# EAGLE design pic18f13k50_3 (EAGLE 6.5.0)
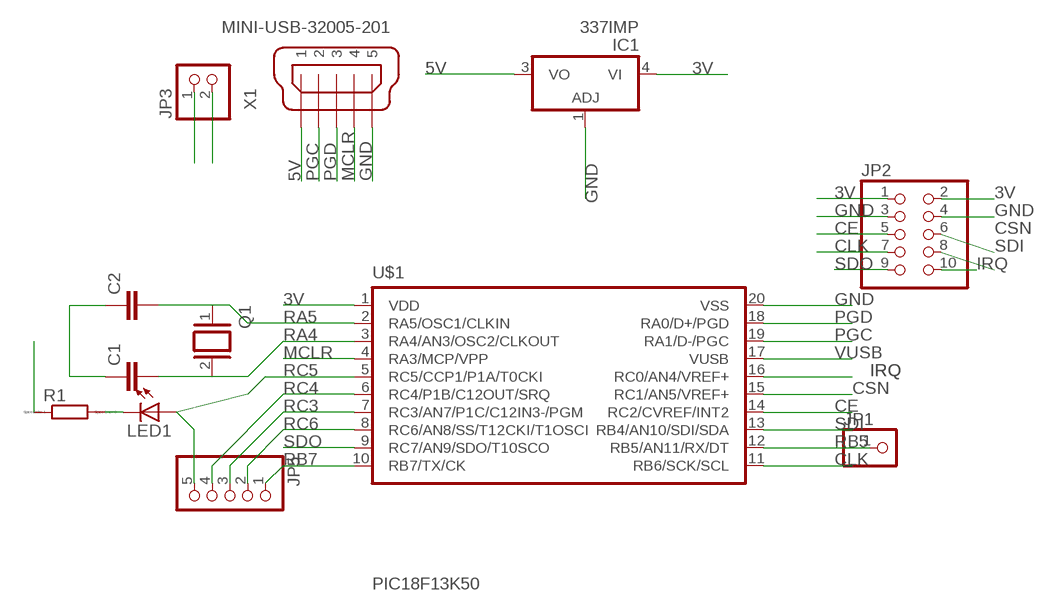
[diagram p0: schematic, sheet 1]

## Parts
C1  C-EUC0805  [C0805]
C2  C-EUC0805  [C0805]
IC1  337IMP  [SOT223]
JP1  PINHD-1X1  [1X01]
JP2  PINHD-2X5  [2X05]
JP3  PINHD-1X2  [1X02]
JP5  PINHD-1X5  [1X05]
LED1  LEDCHIP-LED0805  [CHIP-LED0805]
Q1  XTAL/S  [QS]
R1  R  [R0805]
U$1  PIC18F13K50  [SSOP20]
X1  MINI-USB-32005-201  [32005-201]

## Nets
3V: IC1.4(VI) JP2.1 JP2.2 JP3.1 R1.1 U$1.1(VDD)
5V: IC1.3(VO) JP3.2 X1.1
CE: JP2.5 U$1.14(RC2/CVREF/INT2)
CLK: JP2.7 U$1.11(RB6/SCK/SCL)
CSN: JP2.6 U$1.15(RC1/AN5/VREF+)
GND: C1.1 C2.1 IC1.1(ADJ) JP2.3 JP2.4 U$1.20(VSS) X1.5
IRQ: JP2.10 U$1.16(RC0/AN4/VREF+)
MCLR: U$1.4(RA3/MCP/VPP) X1.4
N$1: LED1.C R1.2
PGC: U$1.19(RA1/D-/PGC) X1.2
PGD: U$1.18(RA0/D+/PGD) X1.3
RA4: C1.2 Q1.2 U$1.3(RA4/AN3/OSC2/CLKOUT)
RA5: C2.2 Q1.1 U$1.2(RA5/OSC1/CLKIN)
RB5: JP1.1 U$1.12(RB5/AN11/RX/DT)
RB7: JP5.1 U$1.10(RB7/TX/CK)
RC3: JP5.3 U$1.7(RC3/AN7/P1C/C12IN3-/PGM)
RC4: JP5.4 U$1.6(RC4/P1B/C12OUT/SRQ)
RC5: JP5.5 LED1.A U$1.5(RC5/CCP1/P1A/T0CKI)
RC6: JP5.2 U$1.8(RC6/AN8/SS/T12CKI/T1OSCI)
SDI: JP2.8 U$1.13(RB4/AN10/SDI/SDA)
SDO: JP2.9 U$1.9(RC7/AN9/SDO/T10SCO)
VUSB: U$1.17(VUSB)

## Library data of the parts
C1 C2 = rcl:C-EU: CAPACITOR, European symbol
IC1 = linear:*337: Negative VOLTAGE REGULATOR
JP1 = pinhead:PINHD-1X1: PIN HEADER
JP2 = pinhead:PINHD-2X5: PIN HEADER
JP3 = pinhead:PINHD-1X2: PIN HEADER
JP5 = pinhead:PINHD-1X5: PIN HEADER
LED1 = led:LED: LED OSRAM: - CHIPLED LG R971, LG N971, LY N971, LG Q971, LY Q971, LO R971, LY R971 LH N974, LH R974 LS Q976, LO Q976, LY Q976 LO Q996 - Hyper CHIPLED LW Q18S LB Q993, LB Q99A, LB R99A - SideLED LS A670, LO A670, LY A670, LG A670, LP A670 LB A673, LV A673, LT A673, LW A673 LH A674 LY A675 LS A676, LA A676, LO A676, LY A676, LW A676 LS A679, LY A679, LG A679 - Hyper Micro SIDELED® LS Y876, LA Y876, LO Y876, LY Y876 LT Y87S - SmartLED LW L88C, LW L88S LB L89C, LB L89S, LG L890 LS L89K, LO L89K, LY L89K LS L896, LA L896, LO L896, LY L896 - TOPLED LS T670, LO T670, LY T670, LG T670, LP T670 LSG T670, LSP T670, LSY T670, LOP T670, LYG T670 LG T671, LOG T671, LSG T671 LB T673, LV T673, LT T673, LW T673 LH T674 LS T676, LA T676, LO T676, LY T676, LB T676, LH T676, LSB T676, LW T676 LB T67C, LV T67C, LT T67C, LS T67K, LO T67K, LY T67K, LW E67C LS E67B, LA E67B, LO E67B, LY E67B, LB E67C, LV E67C, LT E67C LW T67C LS T679, LY T679, LG T679 LS T770, LO T770, LY T770, LG T770, LP T770 LB T773, LV T773, LT T773, LW T773 LH T774 LS E675, LA E675, LY E675, LS T675 LS T776, LA T776, LO T776, LY T776, LB T776 LHGB T686 LT T68C, LB T68C - Hyper Mini TOPLED® LB M676 - Mini TOPLED Santana® LG M470 LS M47K, LO M47K, LY M47K Source: http://www.osram.convergy.de LUXEON: - LUMILED® LXK2-PW12-R00, LXK2-PW12-S00, LXK2-PW14-U00, LXK2-PW14-V00 LXK2-PM12-R00, LXK2-PM12-S00, LXK2-PM14-U00 LXK2-PE12-Q00, LXK2-PE12-R00, LXK2-PE12-S00, LXK2-PE14-T00, LXK2-PE14-U00 LXK2-PB12-K00, LXK2-PB12-L00, LXK2-PB12-M00, LXK2-PB14-N00, LXK2-PB14-P00, LXK2-PB14-Q00 LXK2-PR12-L00, LXK2-PR12-M00, LXK2-PR14-Q00, LXK2-PR14-R00 LXK2-PD12-Q00, LXK2-PD12-R00, LXK2-PD12-S00 LXK2-PH12-R00, LXK2-PH12-S00 LXK2-PL12-P00, LXK2-PL12-Q00, LXK2-PL12-R00 Source: www.luxeon.com KINGBRIGHT: KA-3528ASYC Source: www.kingbright.com
Q1 = special:XTAL/S: CRYSTAL
R1 = eagle-ltspice:R: RESISTOR, European symbol; SPICEMODEL: NONE; SPICEPREFIX: R
U$1 = microchip-7:PIC18F13K50
X1 = con-cypressindustries 2:MINI-USB-: MINI USB-B Conector Source: www.cypressindustries.com

## Board
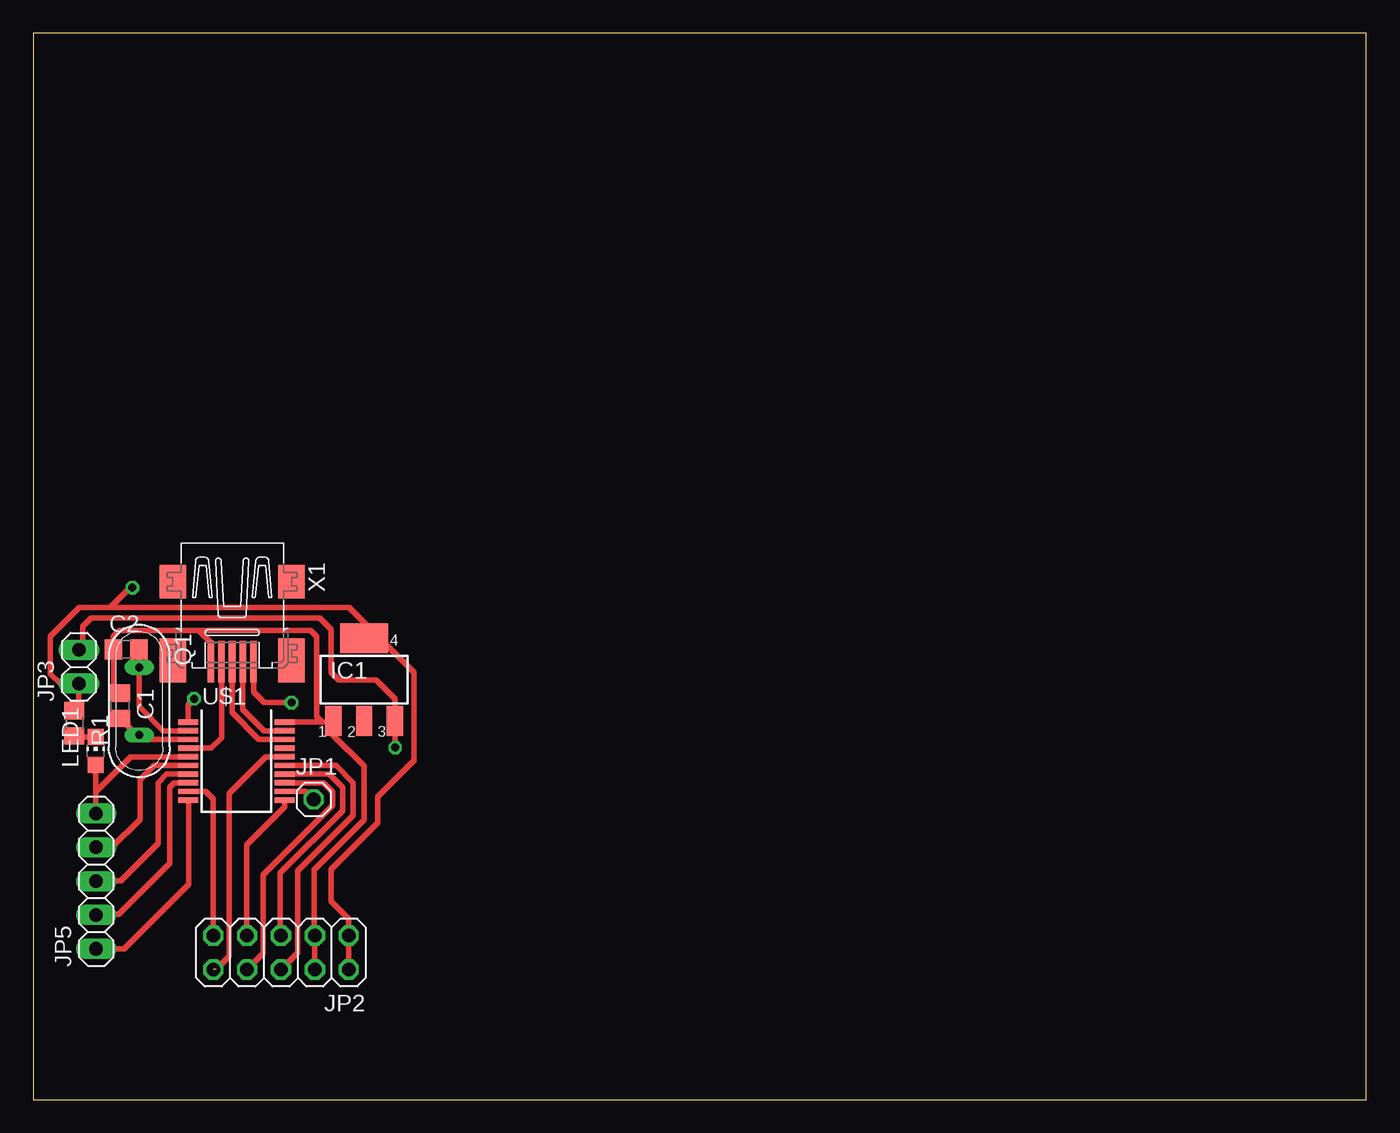
[diagram p1: board, top side]
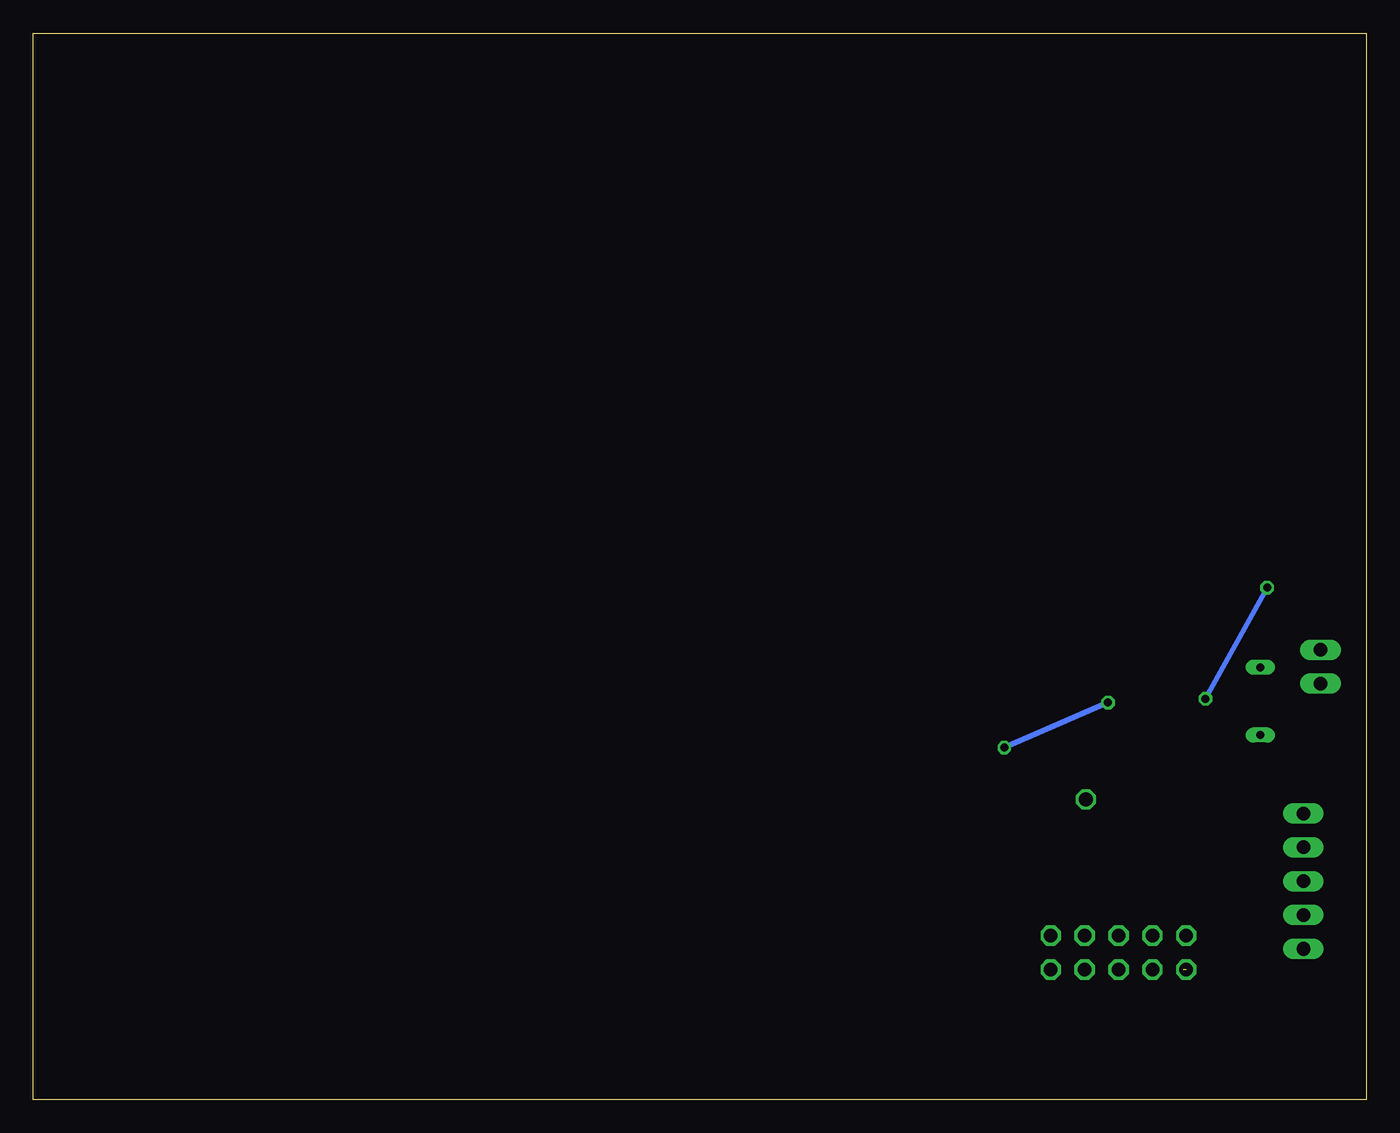
[diagram p2: board, bottom side, seen from below]

Size 100 x 80 mm. Coordinates in mm from the lower left corner, seen from the top.
Outline: 0,0 100,0 100,80 0,80 0,0
Copper layers (1*16): Top 0.035mm / dielectric 1.5mm / Bottom 0.035mm
Design rules "default": minimum track width 10mil, minimum drill 24mil, track to track 8mil, track to pad 8mil, pad to pad 8mil, via to via 8mil, smd to smd 8mil, copper to edge 40mil, drill to drill 8mil, minimum pad ring 10mil, minimum via ring 8mil, stop-mask expansion 4mil, vias tented up to drill 0mil, thermal gap 10mil

### Footprints (pad centres in the part's own frame; a part is rotated, then mirrored left to right if it is on the bottom)
C0805 = smd 1.3 x 1.5: 1 -0.95,0; 2 0.95,0
SOT223 = smd 1.219 x 2.235: 1 -2.311,-3.099; 2 0,-3.099; 3 2.311,-3.099 | smd 3.6 x 2.2: 4 0,3.099
1X01 = drill 1.016 octagon: 1 0,0
2X05 = drill 1.016 octagon: 1 -5.08,-1.27; 2 -5.08,1.27; 3 -2.54,-1.27; 4 -2.54,1.27; 5 0,-1.27; 6 0,1.27; 7 2.54,-1.27; 8 2.54,1.27; 9 5.08,-1.27; 10 5.08,1.27
1X02 = drill 1.016 long: 1 -1.27,0; 2 1.27,0
1X05 = drill 1.016 long: 1 -5.08,0; 2 -2.54,0; 3 0,0; 4 2.54,0; 5 5.08,0
CHIP-LED0805 = smd 1.2 x 1.2: A 0,-1.05; C 0,1.05
QS = drill 0.61 long: 1 -2.54,0; 2 2.54,0
R0805 = smd 1.3 x 1.5: 1 -0.95,0; 2 0.95,0
SSOP20 = smd 0.4 x 1.5: 1 -2.925,-3.625; 2 -2.275,-3.625; 3 -1.625,-3.625; 4 -0.975,-3.625; 5 -0.325,-3.625; 6 0.325,-3.625; 7 0.975,-3.625; 8 1.625,-3.625; 9 2.275,-3.625; 10 2.925,-3.625; 11 2.925,3.625; 12 2.275,3.625; 13 1.625,3.625; 14 0.975,3.625; 15 0.325,3.625; 16 -0.325,3.625; 17 -0.975,3.625; 18 -1.625,3.625; 19 -2.275,3.625; 20 -2.925,3.625
32005-201 = smd 3.1 x 0.5: 1 3,1.6; 2 3,0.8; 3 3,0; 4 3,-0.8; 5 3,-1.6 | smd 2.5 x 2: M1 -3,-4.45; M2 -3,4.45 | smd 3.3 x 2: M3 2.9,4.45; M4 2.9,-4.45

### Placement (x,y rotation side)
C1  6.52,29.55 270 top
C2  6.97,33.78 0 top
IC1  24.82,31.5 0 top
JP1  21.03,22.52 0 top
JP2  18.58,11.03 180 top
JP3  3.42,32.47 90 top
JP5  4.71,16.39 90 top
LED1  4.69,26.17 0 top
Q1  7.94,29.89 270 top
R1  3.09,28.23 270 top
U$1  15.24,25.4 270 top
X1  14.92,35.85 270 top

### Tracks (layer width: path | path; a pad name or v marks a point on that pad's centre or on a via)
3V  (via drill 0.6)
  Top 0.406: 26.06,34.6 IC1.4 24.86,34.56 24.86,34.06 24.8,34.12 24.8,35.38 | 5.77,36.92 23.69,36.92 25.23,35.38 | 5.77,36.92 3.43,36.92 1.26,34.75 1.26,31.95 2,31.2 JP3.1 3.42,29.52 R1.1 | 24.8,35.38 24.75,35.38 | U$1.1 11.62,29.62 v12.06,30.06 | v7.43,38.41 7.26,38.41 5.77,36.92 | 25.23,35.38 28.57,32.03 28.57,25.43 25.83,22.69 25.83,20.75 22.35,17.26 22.35,14.86 23.66,13.54 JP2.1 JP2.2 | 24.8,35.38 25.23,35.38
  Bottom 0.406: v12.06,30.06 v7.43,38.41
5V  (via drill 0.6)
  Top 0.406: X1.1 16.52,30.57 17.32,29.77 v19.37,29.77 | v27.15,26.4 27.15,28.39 IC1.3 27.13,30.07 25.72,31.49 22.92,31.49 22.35,32.06 22.35,35.26 21.49,36.12 4.34,36.12 3.71,35.49 3.71,34.04 JP3.2
  Bottom 0.406: v19.37,29.77 v27.15,26.4
CE
  Top 0.406: U$1.14 22.21,24.43 23.2,23.43 23.2,21.66 18.54,16.99 18.54,12.34 JP2.5
CLK
  Top 0.406: U$1.11 18.86,21.95 16,19.09 16,12.31 JP2.7
CSN
  Top 0.406: U$1.15 22.7,25.07 24,23.77 24,21.32 19.83,17.14 19.83,11.01 JP2.6
GND
  Top 0.406: 12.4,35.2 6.46,35.2 6,34.75 6,34.03 C2.1 | 12.4,35.2 20.8,35.2 21.26,34.75 21.26,28.73 21.66,28.32 | U$1.20 21.66,28.32 | 21.66,28.32 22.43,28.32 IC1.1 22.51,27.32 24.8,25.02 24.8,20.97 21.08,17.25 21.08,12.34 JP2.3 JP2.4 | C2.1 6.02,31.05 C1.1 | 6.06,34.04 C2.1 | X1.5 13.32,34.28 12.4,35.2
IRQ  (1 unrouted)
  Top 0.406: U$1.16 17.44,25.73 14.69,22.97 14.69,10.74 13.7,9.76
MCLR
  Top 0.406: U$1.4 13.35,26.38 14.12,27.15 14.12,32.84 X1.4
N$1
  Top 0.406: LED1.C 3.14,27.23 R1.2
PGC
  Top 0.406: U$1.19 17.3,27.68 15.72,29.26 15.72,31.41 X1.2
PGD
  Top 0.406: U$1.18 16.92,27.02 14.92,29.03 14.92,31.41 X1.3
RA4
  Top 0.406: U$1.3 8.27,27.02 Q1.2 | Q1.2 7.94,27.23 | Q1.2 7.94,27.57 7.54,27.57 C1.2
RA5
  Top 0.406: U$1.2 9.76,27.68 7.94,29.49 Q1.1 7.94,32.6 C2.2
RB5
  Top 0.406: U$1.12 20.42,23.12 JP1.1
RB7
  Top 0.406: U$1.10 11.64,22.48 11.64,16.16 6.8,11.32 4.72,11.32 JP5.1
RC3
  Top 0.406: U$1.7 10.02,24.43 9.37,23.77 9.37,19.2 6.57,16.4 4.73,16.4 JP5.3
RC4
  Top 0.406: U$1.6 9.07,25.07 8,24 8,21.03 5.89,18.92 4.72,18.92 JP5.4
RC5
  Top 0.406: U$1.5 7.32,25.73 4.69,23.09 | LED1.A 4.69,23.09 | 4.69,23.09 4.69,21.49 JP5.5
RC6
  Top 0.406: U$1.8 10.57,23.77 10.23,23.43 10.23,17.72 6.4,13.89 4.75,13.89 JP5.2
SDI  (1 unrouted)
  Top 0.406: U$1.13 21.77,23.77 22.46,23.09 22.46,22.06 17.26,16.86 17.26,10.97 JP2.8
SDO
  Top 0.406: U$1.9 12.94,23.12 13.49,22.57 13.49,12.31 JP2.9